# EAGLE design garden_circ (EAGLE 6.4)
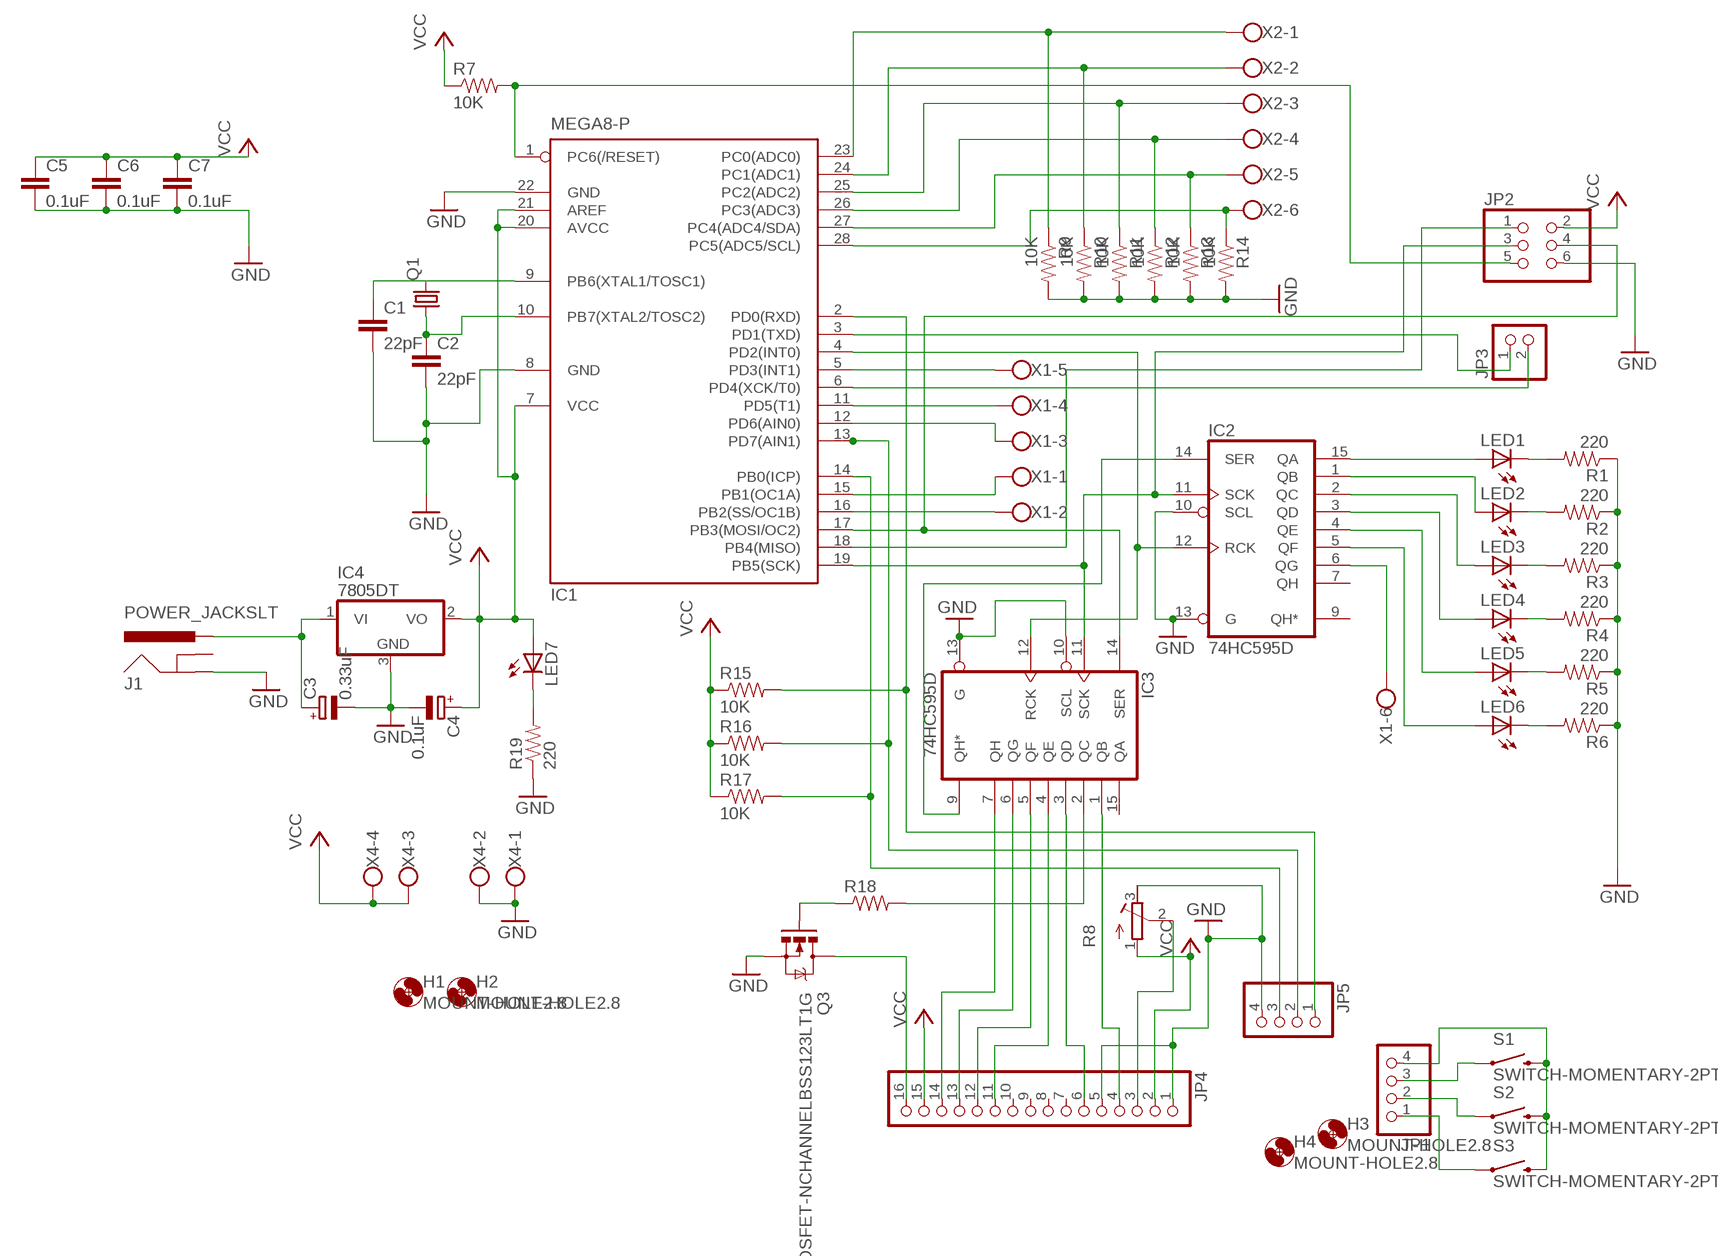
[diagram p0: schematic, sheet 1]

## Parts
C1  22pF  CAP0805  [0805]
C2  22pF  CAP0805  [0805]
C3  0.33uF  CPOL-EUSMCC  [SMC_C]
C4  0.1uF  CPOL-EUSMCC  [SMC_C]
C5  0.1uF  CAP0805  [0805]
C6  0.1uF  CAP0805  [0805]
C7  0.1uF  CAP0805  [0805]
H1  MOUNT-HOLE2.8  [2,8]
H2  MOUNT-HOLE2.8  [2,8]
H3  MOUNT-HOLE2.8  [2,8]
H4  MOUNT-HOLE2.8  [2,8]
IC1  MEGA8-P  [DIL28-3]
IC2  74HC595D  [SO16]
IC3  74HC595D  [SO16]
IC4  7805DT  [TO252]
J1  POWER_JACKSLT  [POWER_JACK_SLOT]
JP1  PINHD-1X4  [1X04]
JP2  PINHD-2X3  [2X03]
JP3  PINHD-1X2  [1X02]
JP4  PINHD-1X16  [1X16]
JP5  PINHD-1X4  [1X04]
LED1  LED3MM  [LED3MM]
LED2  LED3MM  [LED3MM]
LED3  LED3MM  [LED3MM]
LED4  LED3MM  [LED3MM]
LED5  LED3MM  [LED3MM]
LED6  LED3MM  [LED3MM]
LED7  LEDSML0805  [SML0805]
Q1  CRYSTALHC49UP  [HC49UP]
Q3  MOSFET-NCHANNELBSS123LT1G  [SOT23]
R1  220  RESISTOR0805-RES  [0805]
R2  220  RESISTOR0805-RES  [0805]
R3  220  RESISTOR0805-RES  [0805]
R4  220  RESISTOR0805-RES  [0805]
R5  220  RESISTOR0805-RES  [0805]
R6  220  RESISTOR0805-RES  [0805]
R7  10K  RESISTOR0805-RES  [0805]
R8  R-TRIMM3202  [RTRIM3202]
R9  10K  RESISTOR0805-RES  [0805]
R10  10K  RESISTOR0805-RES  [0805]
R11  10K  RESISTOR0805-RES  [0805]
R12  10K  RESISTOR0805-RES  [0805]
R13  10K  RESISTOR0805-RES  [0805]
R14  10K  RESISTOR0805-RES  [0805]
R15  10K  RESISTOR0805-RES  [0805]
R16  10K  RESISTOR0805-RES  [0805]
R17  10K  RESISTOR0805-RES  [0805]
R18  RESISTOR0805-RES  [0805]
R19  220  RESISTOR0805-RES  [0805]
S1  SWITCH-MOMENTARY-2PTH  [TACTILE-PTH]
S2  SWITCH-MOMENTARY-2PTH  [TACTILE-PTH]
S3  SWITCH-MOMENTARY-2PTH  [TACTILE-PTH]
X1  W237-136  [W237-136]
X2  W237-136  [W237-136]
X4  W237-4  [W237-4]

## Nets
GND: C1.2 C2.2 C3.- C4.- C5.2 C6.2 C7.2 IC1.8(GND) IC1.22(GND) IC2.10(SCL) IC2.13(G) IC3.10(SCL) IC3.13(G) IC4.3(GND) J1.GND@2(GND) JP2.6 JP4.1 JP4.5 JP5.4 Q3.2(S) R1.1 R2.1 R3.1 R4.1 R5.1 R6.1 R8.3(A) R9.2 R10.2 R11.2 R12.2 R13.2 R14.2 R19.1 X4.1 X4.2
MISO: IC1.18(PB4(MISO)) JP2.1
N$1: C1.1 IC1.9(PB6(XTAL1/TOSC1)) Q1.2
N$2: C2.1 IC1.10(PB7(XTAL2/TOSC2)) Q1.1
N$3: LED1.K(C) R1.2
N$4: LED2.K(C) R2.2
N$5: LED3.K(C) R3.2
N$6: LED4.K(C) R4.2
N$7: LED5.K(C) R5.2
N$8: LED6.K(C) R6.2
N$9: IC2.6(QG) X1.6
N$10: IC1.1(PC6(/RESET)) JP2.5 R7.2
N$11: IC2.15(QA) LED1.A
N$12: IC2.1(QB) LED2.A
N$13: IC2.2(QC) LED3.A
N$14: IC2.3(QD) LED4.A
N$15: IC1.11(PD5(T1)) X1.4
N$16: IC2.4(QE) LED5.A
N$17: IC2.5(QF) LED6.A
N$19: IC1.6(PD4(XCK/T0)) JP3.2
N$20: IC1.19(PB5(SCK)) IC2.11(SCK) IC3.11(SCK) JP2.3
N$21: IC2.14(SER) IC3.9(QH*)
N$23: IC1.12(PD6(AIN0)) X1.3
N$24: IC1.15(PB1(OC1A)) X1.1
N$25: IC1.24(PC1(ADC1)) R10.1 X2.2
N$26: IC3.3(QD) JP4.6
N$27: IC3.1(QB) JP4.4
N$28: IC3.7(QH) JP4.14
N$29: IC3.6(QG) JP4.13
N$30: IC3.5(QF) JP4.12
N$31: IC1.23(PC0(ADC0)) R9.1 X2.1
N$32: IC1.25(PC2(ADC2)) R11.1 X2.3
N$33: IC1.26(PC3(ADC3)) R12.1 X2.4
N$34: IC1.27(PC4(ADC4/SDA)) R13.1 X2.5
N$35: IC1.28(PC5(ADC5/SCL)) R14.1 X2.6
N$36: IC1.16(PB2(SS/OC1B)) X1.2
N$37: C3.+ IC4.1(VI) J1.PWR
N$39: IC1.2(PD0(RXD)) JP5.1 R15.2
N$40: IC1.13(PD7(AIN1)) JP5.2 R16.2
N$41: IC1.14(PB0(ICP)) JP5.3 R17.2
N$42: IC1.5(PD3(INT1)) X1.5
N$44: IC1.17(PB3(MOSI/OC2)) IC3.14(SER) JP2.4
N$45: IC1.3(PD1(TXD)) JP3.1
N$52: IC1.4(PD2(INT0)) IC2.12(RCK) IC3.12(RCK)
N$59: JP4.3 R8.2(S)
N$65: IC3.4(QE) JP4.11
N$66: JP1.1 S3.1
N$67: JP4.16 Q3.3(D)
N$68: Q3.1(G) R18.1
N$69: IC3.2(QC) R18.2
N$70: JP1.2 S2.1
N$71: JP1.3 S1.1
N$72: JP1.4 S1.3 S2.3 S3.3
N$73: LED7.C R19.2
VCC: C4.+ C5.1 C6.1 C7.1 IC1.7(VCC) IC1.20(AVCC) IC1.21(AREF) IC4.2(VO) JP2.2 JP4.2 JP4.15 LED7.A R7.1 R8.1(E) R15.1 R16.1 R17.1 X4.3 X4.4
Unconnected: IC2.7(QH) IC2.9(QH*) IC3.15(QA) J1.GND@1(GNDBREAK) JP4.7 JP4.8 JP4.9 JP4.10

## Power pins joined to a net without a drawn wire
GND: IC2.8(GND) IC3.8(GND)
VCC: IC2.16(VCC) IC3.16(VCC)

## Library data of the parts
C1 C2 C5-C7 = SparkFun-Capacitors:CAP: Capacitor Standard 0603 ceramic capacitor, and 0.1" leaded capacitor.
C3 C4 = resistor:CPOL-EU: POLARIZED CAPACITOR, European symbol
H1-H4 = holes:MOUNT-HOLE: MOUNTING HOLE with drill center marker
IC1 = atmel:MEGA8-P: MICROCONTROLLER 8 Kbytes FLASH, 1 kbytes SRAM, 512 bytes EEPROM, USART, 4-channel 10 bit ADC, 2-channel 8 bit ADC Pin compatible with Atmega48, ATMega88, ATMega168 Source: avr.lbr; OC_FARNELL: unknown; OC_NEWARK: unknown
IC2 IC3 = 74xx-eu:74*595: 8-bit SHIFT REGISTER, output latch
IC4 = linear:78*: Positive VOLTAGE REGULATOR Source: http://cache.national.com/ds/LM/LM78L05.pdf http://www.fairchildsemi.com/ds/LM/LM7805.pdf
J1 = SparkFun-Connectors:POWER_JACK: Power Jack This is the standard 5.5mm barrel jack for power. The PTH is the most common, proven, reliable, footprint. The Slot footprint only works if the mill layer is transmitted to the PCB fab house so be warned. Spark Fun Electronics SKU : PRT-00119 SMT: CONN-08106 Mating wall wart : TOL-00298 (and others)
JP1 JP5 = pinhead:PINHD-1X4: PIN HEADER
JP2 = pinhead:PINHD-2X3: PIN HEADER
JP3 = pinhead:PINHD-1X2: PIN HEADER
JP4 = pinhead:PINHD-1X16: PIN HEADER
LED1-LED7 = led:LED: LED OSRAM: - CHIPLED LG R971, LG N971, LY N971, LG Q971, LY Q971, LO R971, LY R971 LH N974, LH R974 LS Q976, LO Q976, LY Q976 LO Q996 - Hyper CHIPLED LW Q18S LB Q993, LB Q99A, LB R99A - SideLED LS A670, LO A670, LY A670, LG A670, LP A670 LB A673, LV A673, LT A673, LW A673 LH A674 LY A675 LS A676, LA A676, LO A676, LY A676, LW A676 LS A679, LY A679, LG A679 - Hyper Micro SIDELED® LS Y876, LA Y876, LO Y876, LY Y876 LT Y87S - SmartLED LW L88C, LW L88S LB L89C, LB L89S, LG L890 LS L89K, LO L89K, LY L89K LS L896, LA L896, LO L896, LY L896 - TOPLED LS T670, LO T670, LY T670, LG T670, LP T670 LSG T670, LSP T670, LSY T670, LOP T670, LYG T670 LG T671, LOG T671, LSG T671 LB T673, LV T673, LT T673, LW T673 LH T674 LS T676, LA T676, LO T676, LY T676, LB T676, LH T676, LSB T676, LW T676 LB T67C, LV T67C, LT T67C, LS T67K, LO T67K, LY T67K, LW E67C LS E67B, LA E67B, LO E67B, LY E67B, LB E67C, LV E67C, LT E67C LW T67C LS T679, LY T679, LG T679 LS T770, LO T770, LY T770, LG T770, LP T770 LB T773, LV T773, LT T773, LW T773 LH T774 LS E675, LA E675, LY E675, LS T675 LS T776, LA T776, LO T776, LY T776, LB T776 LHGB T686 LT T68C, LB T68C - Hyper Mini TOPLED® LB M676 - Mini TOPLED Santana® LG M470 LS M47K, LO M47K, LY M47K Source: http://www.osram.convergy.de LUXEON: - LUMILED® LXK2-PW12-R00, LXK2-PW12-S00, LXK2-PW14-U00, LXK2-PW14-V00 LXK2-PM12-R00, LXK2-PM12-S00, LXK2-PM14-U00 LXK2-PE12-Q00, LXK2-PE12-R00, LXK2-PE12-S00, LXK2-PE14-T00, LXK2-PE14-U00 LXK2-PB12-K00, LXK2-PB12-L00, LXK2-PB12-M00, LXK2-PB14-N00, LXK2-PB14-P00, LXK2-PB14-Q00 LXK2-PR12-L00, LXK2-PR12-M00, LXK2-PR14-Q00, LXK2-PR14-R00 LXK2-PD12-Q00, LXK2-PD12-R00, LXK2-PD12-S00 LXK2-PH12-R00, LXK2-PH12-S00 LXK2-PL12-P00, LXK2-PL12-Q00, LXK2-PL12-R00 Source: www.luxeon.com KINGBRIGHT: KA-3528ASYC Source: www.kingbright.com
Q1 = crystal:CRYSTAL: CRYSTAL; OC_FARNELL: unknown; OC_NEWARK: unknown
Q3 = SparkFun-DiscreteSemi:MOSFET-NCHANNEL: Common NMOSFET Parts MFG P/N Store ID Prod ID FDD8780 TRANS-09984 SI7820DN TRANS-11055 FDS6630A IC-08089 2N7002PW TRANS-11151 FQP30N06L COM-10213 TRANS-10060 BSS123LT1G TRANS-08345 BSS138 TRANS-00830 BS170 2N7000; PROD_ID: TRANS-08345
R1-R7 R9-R19 = SparkFun-Resistors:RESISTOR: Resistor Basic schematic elements and footprints for 0603, 1206, and PTH resistors.
R8 = resistor:R-TRIMM: Trimm resistor
S1-S3 = SparkFun-Electromechanical:SWITCH-MOMENTARY-2: Various NO switches- pushbuttons, reed, etc
X1 X2 = con-wago-500:W237-136: WAGO SCREW CLAMP; MPN: 237-136; OC_FARNELL: unknown; OC_NEWARK: 84K9151
X4 = con-wago-500:W237-4: WAGO SCREW CLAMP; OC_FARNELL: unknown; OC_NEWARK: unknown

## Board
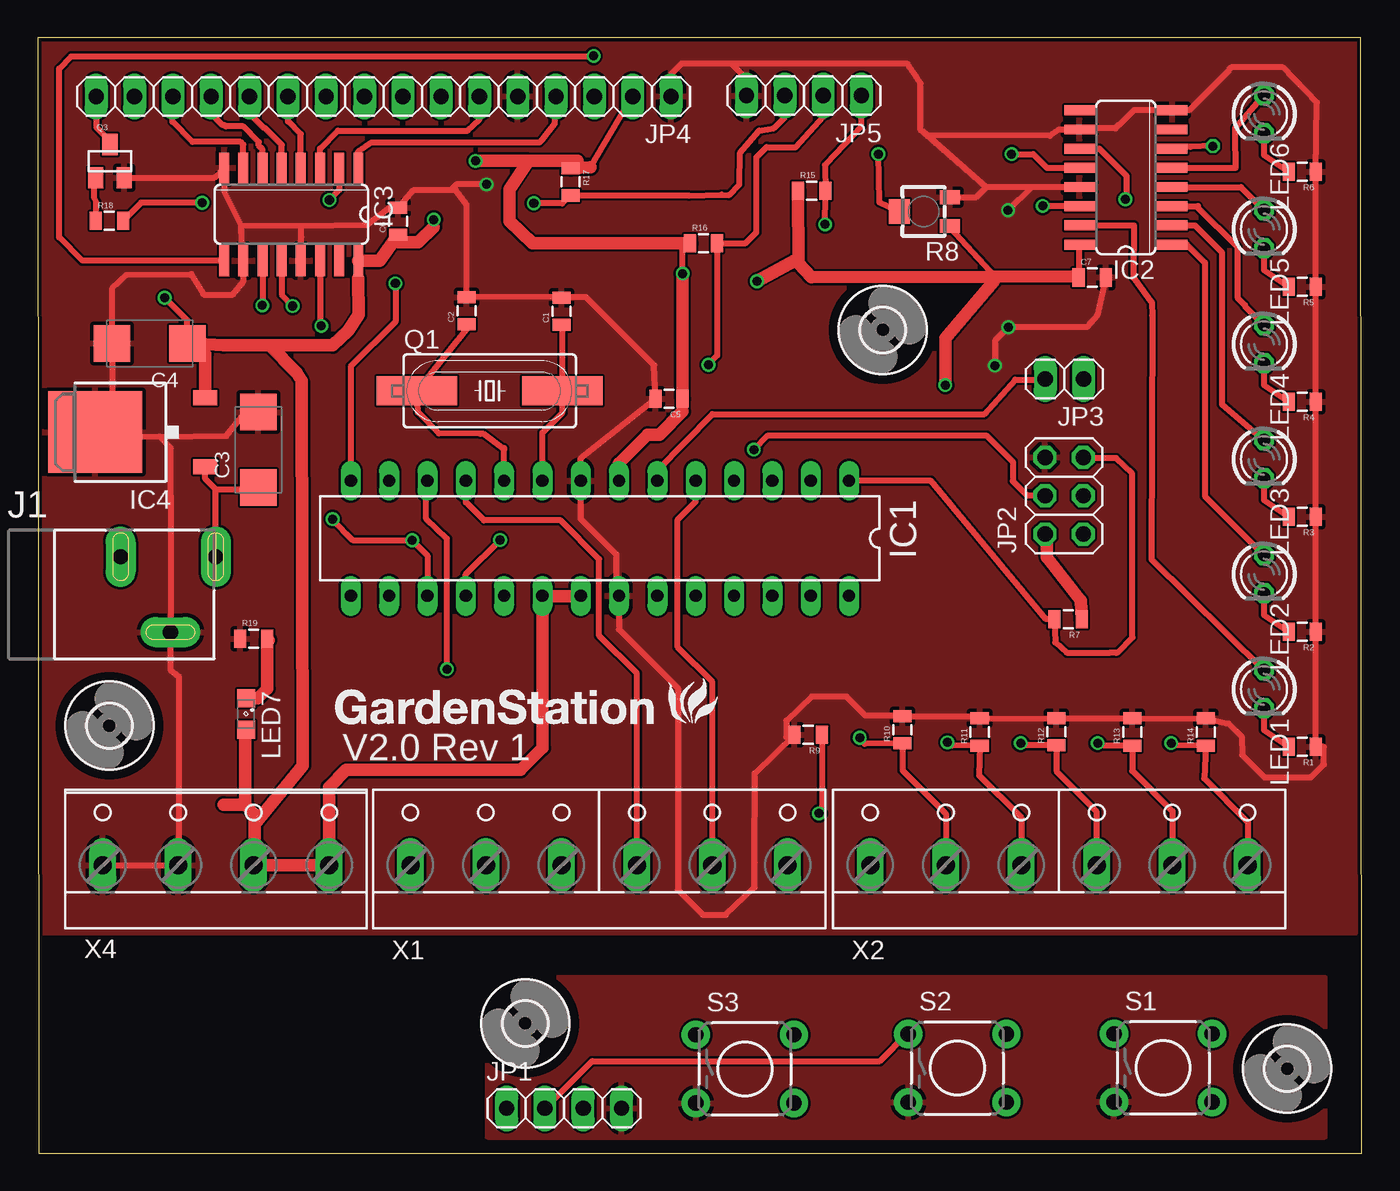
[diagram p1: board, top side]
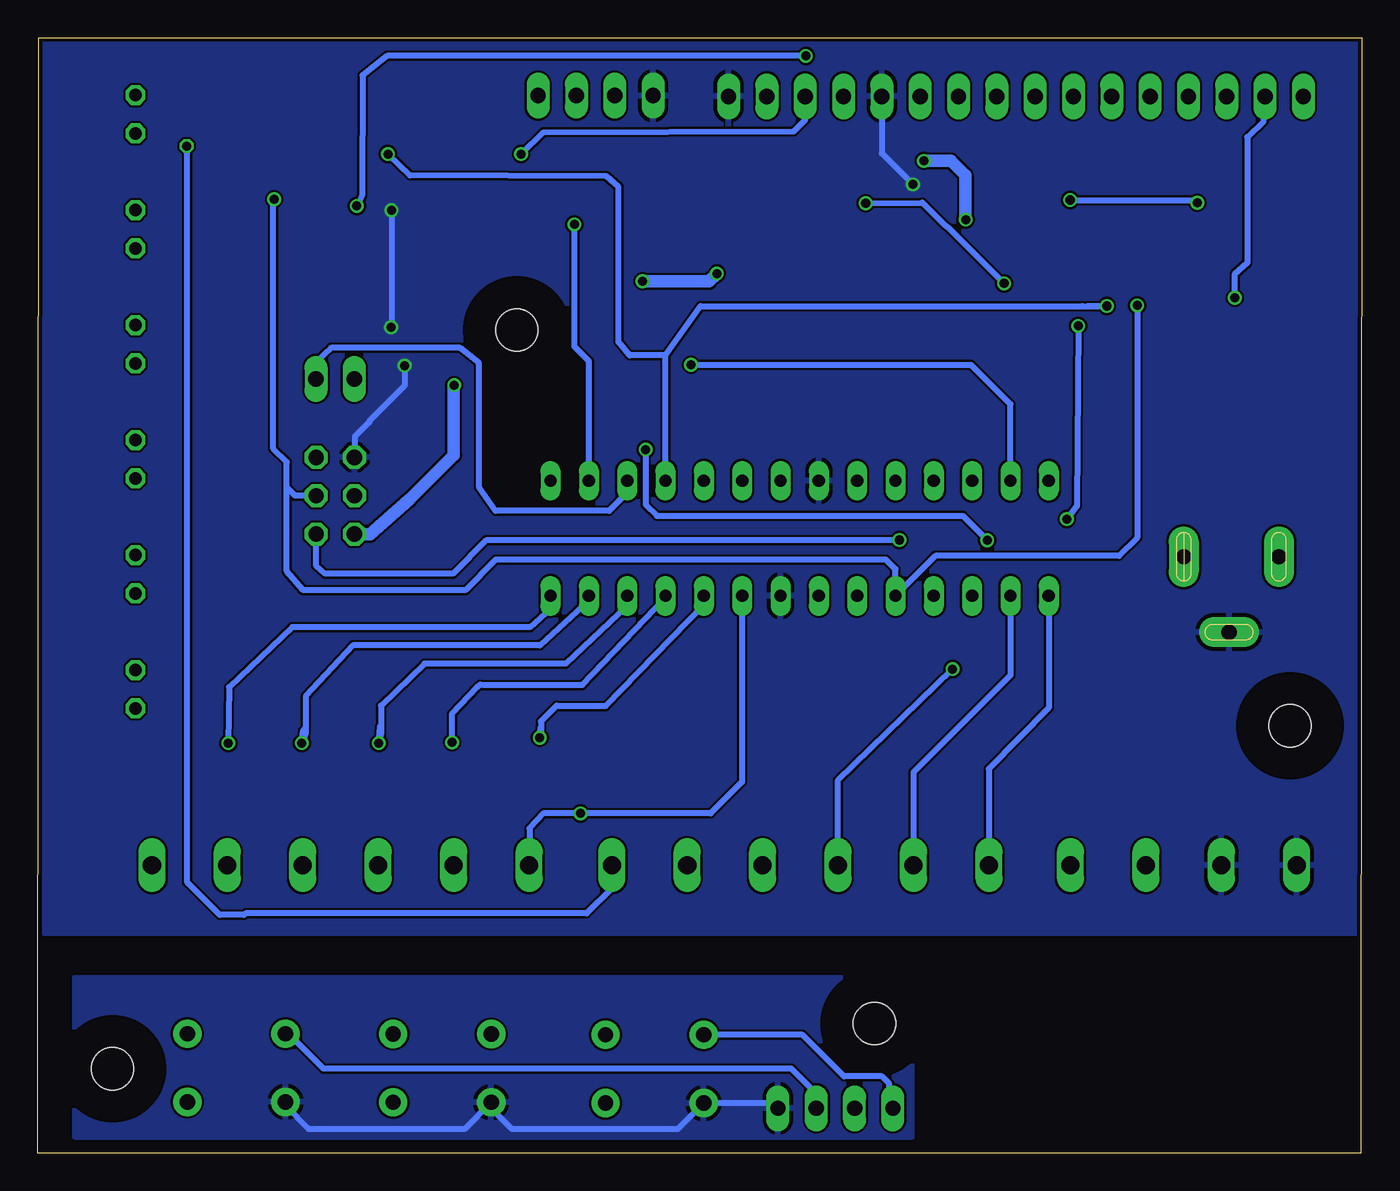
[diagram p2: board, bottom side, seen from below]

Size 87.76 x 73.91 mm. Coordinates in mm from the lower left corner, seen from the top.
Outline: 0.05,0 87.76,0 87.71,73.91 0,73.91 0.05,0
Copper layers (1*16): Top 0.035mm / dielectric 1.5mm / Bottom 0.035mm
Design rules "Elecrow_2-layer_eagle_rule": minimum track width 6mil, minimum drill 12mil, track to track 6mil, track to pad 6mil, pad to pad 6mil, via to via 6mil, smd to smd 0mil, copper to edge 10mil, drill to drill 10mil, minimum pad ring 10mil, minimum via ring 6mil, stop-mask expansion 2mil, vias tented up to drill 100mil, thermal gap 10mil

### Footprints (pad centres in the part's own frame; a part is rotated, then mirrored left to right if it is on the bottom)
0805 = smd 0.8 x 1.2: 1 -0.9,0; 2 0.9,0
SMC_C = smd 2.4 x 2.4: + -2.5,0; - 2.5,0
2,8 = hole 2.8: 0,0
DIL28-3 = drill 0.813 long: 1 -16.51,-3.81; 2 -13.97,-3.81; 3 -11.43,-3.81; 4 -8.89,-3.81; 5 -6.35,-3.81; 6 -3.81,-3.81; 7 -1.27,-3.81; 8 1.27,-3.81; 9 3.81,-3.81; 10 6.35,-3.81; 11 8.89,-3.81; 12 11.43,-3.81; 13 13.97,-3.81; 14 16.51,-3.81; 15 16.51,3.81; 16 13.97,3.81; 17 11.43,3.81; 18 8.89,3.81; 19 6.35,3.81; 20 3.81,3.81; 21 1.27,3.81; 22 -1.27,3.81; 23 -3.81,3.81; 24 -6.35,3.81; 25 -8.89,3.81; 26 -11.43,3.81; 27 -13.97,3.81; 28 -16.51,3.81
SO16 = smd 0.66 x 2.032: 1 -4.445,-3.073; 2 -3.175,-3.073; 3 -1.905,-3.073; 4 -0.635,-3.073; 5 0.635,-3.073; 6 1.905,-3.073; 7 3.175,-3.073; 8 4.445,-3.073; 9 4.445,3.073; 10 3.175,3.073; 11 1.905,3.073; 12 0.635,3.073; 13 -0.635,3.073; 14 -1.905,3.073; 15 -3.175,3.073; 16 -4.445,3.073
TO252 = smd 1 x 1.6: 1 -2.28,-4.8; 2 2.28,-4.8 | smd 5.4 x 6.2: 3 0,2.5
POWER_JACK_SLOT = drill 1 pad 2 long: GND@1 2.58,7.5; GND@2 7.58,10.8; PWR 2.58,13.8
1X04 = drill 1.016 long: 1 -3.81,0; 2 -1.27,0; 3 1.27,0; 4 3.81,0
2X03 = drill 1.016 octagon: 1 -2.54,-1.27; 2 -2.54,1.27; 3 0,-1.27; 4 0,1.27; 5 2.54,-1.27; 6 2.54,1.27
1X02 = drill 1.016 long: 1 -1.27,0; 2 1.27,0
1X16 = drill 1.016 long: 1 -19.05,0; 2 -16.51,0; 3 -13.97,0; 4 -11.43,0; 5 -8.89,0; 6 -6.35,0; 7 -3.81,0; 8 -1.27,0; 9 1.27,0; 10 3.81,0; 11 6.35,0; 12 8.89,0; 13 11.43,0; 14 13.97,0; 15 16.51,0; 16 19.05,0
LED3MM = drill 0.813 octagon: A -1.27,0; K 1.27,0
SML0805 = smd 1.2 x 1.2: A 1.05,0; C -1.05,0
HC49UP = smd 5.334 x 1.93: 1 -4.826,0; 2 4.826,0
SOT23 = smd 1 x 1.4: 1 -0.95,-1.1; 2 0.95,-1.1; 3 0,1.1
RTRIM3202 = smd 0.9 x 1.3: 1 -0.95,-1.75; 3 0.95,-1.75 | smd 1.6 x 1.4: 2 0,1.6
TACTILE-PTH = drill 1.016 pad 1.88: 1 -3.251,2.261; 2 3.251,2.261; 3 -3.251,-2.261; 4 3.251,-2.261
W237-136 = drill 1.194 long: 1 -12.5,-1.27; 2 -7.5,-1.27; 3 -2.5,-1.27; 4 2.5,-1.27; 5 7.5,-1.27; 6 12.5,-1.27
W237-4 = drill 1.194 long: 1 -7.5,-1.27; 2 -2.5,-1.27; 3 2.5,-1.27; 4 7.5,-1.27

### Placement (x,y rotation side)
C1  34.71,55.78 90 top
C2  28.42,55.81 90 top
C3  14.62,46.6 90 top
C4  7.42,53.65 180 top
C5  41.84,49.98 180 top
C6  23.9,61.75 90 top
C7  69.89,58.02 0 top
H1  4.75,28.32 0 top
H2  56.01,54.55 0 top
H3  32.31,8.6 0 top
H4  82.81,5.6 0 top
IC1  37.26,40.74 180 top
IC2  72.12,64.65 90 top
IC3  16.81,62.2 180 top
IC4  6.31,47.77 90 top
J1  -2,42.1 270 top
JP1  34.89,2.97 0 top
JP2  68.03,43.56 90 top
JP3  68.05,51.3 180 top
JP4  22.92,70.02 180 top
JP5  50.78,70.07 180 top
LED1  81.28,30.74 270 top
LED2  81.28,38.36 270 top
LED3  81.28,45.98 270 top
LED4  81.28,53.6 270 top
LED5  81.28,61.22 270 top
LED6  81.28,68.84 270 top
LED7  13.81,29.1 270 top
Q1  29.96,50.51 0 top
Q3  4.79,65.73 0 top
R1  83.82,26.93 180 top
R2  83.82,34.55 180 top
R3  83.82,42.17 180 top
R4  83.82,49.79 180 top
R5  83.82,57.41 180 top
R6  83.82,65.03 180 top
R7  68.3,35.36 180 top
R8  58.71,62.39 90 top
R9  51.07,27.71 180 top
R10  57.32,28.05 90 top
R11  62.43,27.91 90 top
R12  67.53,27.92 90 top
R13  72.55,27.91 90 top
R14  77.43,27.91 90 top
R15  51.3,63.78 0 top
R16  44.14,60.29 0 top
R17  35.33,64.35 270 top
R18  4.75,61.77 0 top
R19  14.31,34.1 0 top
S1  74.59,5.65 0 top
S2  60.95,5.64 0 top
S3  46.87,5.58 0 top
X1  37.21,20.36 0 top
X2  67.69,20.36 0 top
X4  11.81,20.36 0 top

### Tracks (layer width: path | path; a pad name or v marks a point on that pad's centre or on a via)
GND  (via drill 0.6)
  Top 0.406: 58.95,67.45 67.09,67.4 67.69,67.83 IC2.10 69.12,67.9 71.43,67.9 71.66,68.13 71.68,68.13 72.64,69.1 IC2.8 75.21,69.11 76.32,69.11 78.97,71.76 78.97,71.81 79.09,71.94 82.54,71.94 84.78,69.61 R6.1 R5.1 R4.1 R3.1 R2.1 R1.1 85.24,26.93 85.24,25.76 84.37,24.89 81.31,24.89 79.84,26.37 79.8,27.59 78.92,28.46 R14.2 77.72,28.8 R13.2 72.78,28.83 R12.2 67.97,28.8 R11.2 62.38,28.94 R10.2 57.27,28.99 54.86,28.99 53.61,30.24 51.3,30.24 49.61,28.66 49.61,27.59 R9.2 47.53,25.18 47.51,19.26 47.51,17.62 45.59,15.79 44.99,15.79 44.94,15.79 44.08,15.79 42.43,17.44 42.43,30.81 38.53,34.71 IC1.22 38.34,37.12 38.34,39.68 35.99,42.03 IC1.8 35.99,46.03 C5.2 40.85,52.22 36.33,56.72 35.05,56.72 C1.2 34.38,56.73 C2.2 28.41,62.85 27.71,63.81 27.37,63.81 | 58.95,67.45 58.52,67.83 58.52,70.89 58.23,71.32 57.65,72.17 45.98,72.19 | 27.37,63.81 24.9,63.79 C6.2 23.31,62.65 21.8,61.48 17.46,61.41 | 13.5,60.36 13.5,61.47 12.36,63.71 IC3.8 11.72,64.63 Q3.2 | 13.5,60.36 13.5,59.26 IC3.10 13.64,59.12 13.64,57.78 12.91,56.89 11.01,56.89 10.96,56.93 10.19,58.16 10.19,58.25 5.89,58.19 4.95,57.31 C4.- 4.92,48.88 IC4.3 5.78,47.5 8.08,47.48 | 8.08,47.48 12.5,47.53 13.73,49.11 C3.- | X4.1 X4.2 9.36,19.14 9.36,31.58 8.8,32.03 J1.GND@2 8.81,35.4 8.82,43.54 8.82,46.69 8.08,47.48 | 17.46,61.41 13.48,61.46 13.5,60.36 | IC3.13 17.46,60.69 17.46,61.41 | 62.89,64.02 IC2.13 65.85,64.02 v64.31,62.48 | 62.89,64.02 58.95,67.45 | C7.2 70.22,55.53 69.54,54.73 v64.33,54.73 63.44,53.84 v63.44,52.18 | 13.46,61.5 13.5,60.36 | 45.98,72.19 42.68,72.19 42.04,71.55 42.04,70.08 JP4.1 | JP5.4 46.98,71.2 45.98,72.19
  Top 0.406: 58.64,67.73 62.89,64.02 | R8.3 62.21,63.34 62.89,64.02 | v29.75,64.19 27.75,64.19 27.37,63.81
  Bottom 0.406: v63.44,52.18 63.44,50.83 65.79,48.49 65.79,48.41 66.75,47.45 66.75,46.11 JP2.6 | v64.31,62.48 64.31,54.74 v64.33,54.73 | JP4.5 31.81,66.25 v29.75,64.19
  pour Bottom: 0.31,73.6 87.31,73.6 87.31,14.6 0.31,14.6
  pour Top: 0.31,73.6 87.31,73.6 87.31,14.6 0.31,14.6
MISO  (via drill 0.6)
  Top 0.406: IC1.18 28.37,38.36 v30.64,40.63
  Bottom 0.406: v30.64,40.63 58.04,40.61 60.24,38.4 68.71,38.4 69.29,38.92 JP2.1
N$1
  Top 0.406: C1.1 34.77,54.66 Q1.2 34.78,50.12 34.78,49.07 33.45,47.74 IC1.9
N$2
  Top 0.406: IC1.10 30.92,46.64 | 30.92,46.64 30.92,46.71 | 30.92,46.64 29.54,47.67 29.33,47.67 26.59,47.69 25.2,49.09 Q1.1 28.43,54.6 C2.1
N$3
  Top 0.406: LED1.K 81.28,28.04 R1.2
N$4
  Top 0.406: LED2.K 81.28,35.66 R2.2
N$5
  Top 0.406: LED3.K 81.28,43.28 R3.2
N$6
  Top 0.406: LED4.K 81.28,50.9 R4.2
N$7
  Top 0.406: LED5.K 81.28,58.52 R5.2
N$8
  Top 0.406: LED6.K 81.28,66.14 R6.2
N$9  (via drill 0.6)
  Top 0.406: v77.88,66.73 77.88,66.76 76.41,66.67 75.31,66.67 IC2.6
  Bottom 0.406: X1.6 49.71,17.56 51.37,15.9 73.97,15.9 74.08,15.79 75.7,15.79 77.85,17.94 77.85,66.8 v77.88,66.73
N$10
  Top 0.406: 71.04,33.14 68.21,33.16 67.44,33.85 R7.2 66.82,35.38 59.21,44.54 53.78,44.54 IC1.1 | 71.48,33.14 71.04,33.14 | 71.04,33.14 71.59,33.18 72.56,34.17 72.55,45.04 71.48,46.05 69.24,46.03 69.33,46.03 69.33,46.07 JP2.5
N$11
  Top 0.406: IC2.15 72.66,61.48 72.62,58.03 73.84,56.36 73.86,55.49 73.83,39.35 LED1.A
N$12
  Top 0.406: IC2.1 76.17,60.21 77.37,59.01 77.37,43.54 LED2.A
N$13
  Top 0.406: IC2.2 76.7,61.48 78.49,59.69 78.49,49.61 LED3.A
N$14
  Top 0.406: IC2.3 76.9,62.75 76.87,62.75 76.87,62.67 79.52,60.06 79.52,56.68 80.02,56.18 80.02,56.13 LED4.A
N$15
  Top 0.406: X1.4 39.71,31.79 37.22,34.28 37.22,39.36 34.66,41.93 29.57,41.93 28.38,43.12 28.38,44.54 IC1.11
N$16
  Top 0.406: IC2.4 79.75,64.02 LED5.A
N$17
  Top 0.406: IC2.5 79.41,65.29 79.38,67.51 79.38,67.92 LED6.A
N$19
  Top 0.406: IC1.6 41.07,45.24 44.72,48.97 62.73,48.97 64.8,51.26 66.76,51.26 66.76,51.27 JP3.2
N$20  (via drill 0.6)
  Top 0.406: IC2.11 70.36,66.56 72.16,64.75 72.16,63.28 v72.09,63.21 | IC3.11 14.9,56.18 v14.89,56.17
  Bottom 0.406: 72.07,63.23 v72.09,63.21 72.14,63.15 72.14,46.69 71.25,45.8 71.25,44.11 | v14.89,56.17 14.89,40.79 16.1,39.58 28.26,39.58 IC1.19 30.91,38.69 31.55,39.33 57.4,39.33 59.41,37.3 70.17,37.3 71.25,38.56 71.25,44.11 | JP2.3 70.7,43.56 71.25,44.11
N$21  (via drill 0.6)
  Top 0.406: IC3.9 2.96,59.13 1.41,60.68 1.41,71.87 2.21,72.67 36.81,72.67 v36.84,72.7 | v66.61,62.76 69.03,62.76 IC2.14
  Bottom 0.406: v36.84,72.7 64.6,72.7 66.24,71.4 66.27,63.42 v66.61,62.76
N$23  (via drill 0.6)
  Top 0.406: v27.12,32.08 27.12,33.28 27.12,33.91 27.12,34.42 27.12,35.17 27.12,40.72 25.75,42.03 25.75,44.47 IC1.12
  Bottom 0.406: X1.3 34.71,24.72 v27.12,32.08
N$24
  Bottom 0.406: IC1.15 20.75,29.5 24.72,25.46 24.72,19.21 X1.1
N$25  (via drill 0.6)
  Top 0.406: X2.2 60.19,22.49 57.32,25.36 R10.1 54.83,27.13 v54.48,27.52
  Bottom 0.406: IC1.24 43.61,36.33 50.11,29.62 53.19,29.62 53.36,29.66 | 53.36,29.66 | 53.36,29.66 54.41,28.61 54.41,27.99 | 54.41,27.99 54.45,27.67 54.43,28.23 v54.48,27.52 54.41,27.99
N$26
  Top 0.406: IC3.3 18.71,66.55 19.88,67.76 28.51,67.76 29.27,68.49 JP4.6
N$27
  Top 0.406: IC3.1 21.25,66.37 22.11,66.98 33.25,66.98 33.5,67.23 33.56,67.3 34.29,68.24 34.29,70.09 | 34.29,70.1 34.29,70.09 | 34.29,70.09 JP4.4
N$28
  Top 0.406: IC3.7 13.63,66.83 13.45,67.01 10.25,67.01 8.93,68.33 8.93,69.99 JP4.14
N$29
  Top 0.406: IC3.6 14.9,66.52 14.66,66.76 14.66,66.99 13.62,68.03 12.47,68.03 12.38,68.12 12.26,68.12 11.49,68.88 JP4.13
N$30
  Top 0.406: IC3.5 16.17,66.81 15.07,67.92 15.01,67.92 14.05,68.88 14.05,70 JP4.12
N$31  (via drill 0.6)
  Top 0.406: R9.1 51.99,22.97 v51.78,22.51
  Bottom 0.406: IC1.23 41.07,24.6 43.16,22.51 v51.78,22.51 54.23,22.51 55.18,21.51 55.19,19.07 X2.1
N$32  (via drill 0.6)
  Top 0.406: X2.3 65.19,22.24 62.4,25.03 R11.1 60.61,27.02 v60.3,27.22
  Bottom 0.406: IC1.25 46.15,36.8 51.67,31.01 58.25,31.01 58.43,31.04 58.64,30.88 60.3,29.11 v60.3,27.22
N$33  (via drill 0.6)
  Top 0.406: X2.4 70.17,19.11 70.17,22.67 67.53,25.31 R12.1 65.55,27.04 v65.15,27.17
  Bottom 0.406: IC1.26 48.69,36.29 52.76,32.43 62.13,32.43 65.01,29.66 65.01,28.34 | 65.01,28.34 65.01,27.83 v65.15,27.17 65.08,28.27 65.01,28.34
N$34  (via drill 0.6)
  Top 0.406: X2.5 75.21,19.12 75.21,22.67 72.55,25.33 R13.1 70.69,27 v70.25,27.17
  Bottom 0.406: IC1.27 51.23,36.63 54.47,33.64 66.86,33.64 69.99,30.26 69.99,28.18 | 69.99,28.18 69.99,27.86 v70.25,27.17 70.17,28 69.99,28.18
N$35  (via drill 0.6)
  Top 0.406: X2.6 80.21,19.11 80.21,21.94 77.31,24.84 R14.1 75.28,27.02 v75.13,27.17
  Bottom 0.406: IC1.28 53.77,36.06 55.14,34.85 70.89,34.85 75.07,30.88 v75.13,27.17
N$36
  Bottom 0.406: IC1.16 23.29,31.67 29.71,25.25 29.71,19.1 X1.2
N$37
  Top 0.406: J1.PWR 11.8,43.98 | 11.8,43.98 11.1,44.68 11.1,45.51 IC4.1 | 11.8,43.98 14.91,43.98 C3.+
N$39  (via drill 0.6)
  Top 0.406: v52.19,61.54 52.21,63.44 R15.2 52.19,65.41 52.25,65.54 54.59,68.04 JP5.1
  Bottom 0.406: IC1.2 51.23,52.49 52.19,53.45 v52.19,61.54
N$40  (via drill 0.6)
  Top 0.406: v44.46,52.24 45.02,52.84 R16.2 46.93,60.29 47.64,61 47.64,65.98 48.33,66.67 48.47,66.64 50.22,66.64 52.08,68.7 52.08,70.04 JP5.2
  Bottom 0.406: IC1.13 23.29,49.63 25.89,52.24 v44.46,52.24
N$41  (via drill 0.6)
  Top 0.406: v32.88,62.94 34.76,62.93 R17.2 43.09,63.46 43.16,63.45 45.33,63.52 45.81,63.47 46.5,64.19 46.55,66.28 47.82,67.76 48.79,67.92 49.52,68.65 49.52,70.06 JP5.3 | v23.71,57.62 23.71,55.08 20.75,52.13 IC1.14
  Bottom 0.406: v32.88,62.94 29.13,62.98 27.67,61.52 27.4,61.32 v23.71,57.62
N$42
  Top 0.406: X1.5 44.71,31.23 42.41,33.53 42.41,41.98 43.6,43.17 43.6,44.54 IC1.5
N$44  (via drill 0.6)
  Top 0.406: IC3.14 18.71,54.9 v18.8,54.82 | v19.54,42.01 20.45,41.04 20.88,40.63 v24.83,40.61 25.84,39.6 IC1.17 | v47.46,46.62 48.37,47.53 62.93,47.53 64.63,45.82 64.63,44.52 65.58,43.58 66.74,43.58 JP2.4
  Bottom 0.406: v18.8,54.82 18.87,42.89 v19.54,42.01 | v47.46,46.62 47.46,42.97 46.71,42.23 26.44,42.23 v24.83,40.61
N$45
  Bottom 0.406: IC1.3 48.69,43.75 49.88,42.57 57.4,42.57 58.5,44.11 58.52,52.36 59.78,53.36 68.32,53.36 69.28,52.49 69.31,51.16 JP3.1
N$52  (via drill 0.6)
  Top 0.406: v64.55,66.19 65.99,66.19 66.89,65.29 IC2.12 | IC3.12 16.17,56.89 v16.9,56.13
  Bottom 0.406: IC1.4 46.15,52.85 | 46.15,52.85 43.82,56.13 18.53,56.13 18.16,56.12 | 18.16,56.12 v16.9,56.13 18.15,56.11 18.16,56.12 | 46.15,52.85 48.52,52.85 49.27,53.75 49.27,64.03 50.06,64.72 63.09,64.79 64.53,66.19 64.49,66.14 v64.55,66.19
N$59  (via drill 0.6)
  Top 0.406: R8.2 55.78,63.01 v55.73,66.19
  Bottom 0.406: v55.73,66.19 55.73,66.18 54.22,67.64 37.65,67.71 36.88,68.47 36.88,70 JP4.3
N$65
  Top 0.406: IC3.4 17.44,67.52 16.59,68.36 16.59,70 JP4.11
N$66
  Bottom 0.406: JP1.1 31.31,3.2 31.31,4.6 31.81,5.1 34.31,5.1 37.06,7.84 S3.1
N$67
  Top 0.406: Q3.3 4.79,67.07 3.9,67.96 3.9,69.99 JP4.16
N$68
  Top 0.406: R18.1 3.87,63.02 3.74,63.31 3.74,64.64 Q3.1
N$69  (via drill 0.6)
  Top 0.406: IC3.2 19.98,63.8 v19.33,63.15 | v10.9,62.98 6.84,62.98 R18.2
  Bottom 0.406: v19.33,63.15 11.08,63.15 v10.9,62.98
N$70
  Top 0.406: JP1.2 36.74,6.1 55.81,6.1 57.61,7.9 S2.1
N$71
  Bottom 0.406: JP1.3 36.31,3.12 36.31,4.1 37.81,5.6 68.81,5.6 71.13,7.91 S1.1
N$72
  Bottom 0.406: JP1.4 39.05,3.32 S3.3 45.35,1.6 56.31,1.6 57.7,2.99 S2.3 59.48,1.6 69.81,1.6 71.34,3.13 S1.3
  pour Top: 29.81,1.1 85.31,1.1 85.31,11.6 29.81,11.6
  pour Bottom: 29.81,11.6 85.31,11.6 85.31,1.1 29.81,1.1
N$73
  Top 0.813: 15.31,34 R19.2 15.21,30.78 14.58,30.15 LED7.C
VCC  (via drill 0.6)
  Top 0.406: 42.75,49.14 C5.1 | v42.74,58.28 42.74,60.16 R16.1 | IC3.16 21.25,57.96 | 33.47,36.91 IC1.20 | C4.+ 10.47,53.51 | 14.39,19.17 X4.3 | 35.97,36.91 IC1.21 | 31.28,63.85 31.26,63.9 31.28,63.88 | 50.41,58.98 50.23,59.15 | v26.25,61.86 26.25,61.36 | 23.91,60.36 C6.1 | 35.78,65.75 R17.1 | 36.65,65.31 JP4.2 | 11.11,52.96 10.61,52.96 C4.+ | 10.04,53.65 C4.+ | C4.+ 9.92,55.18 v8.42,56.68 | R8.1 60.47,61.36 63.48,58.07 | 68.77,58.03 69.05,58.05 IC2.16 | 63.36,57.75 63.75,57.98 63.51,58.06 | C7.1 68.6,58.02 68.65,58.09
  Top 0.813: R17.1 36.65,65.31 | IC1.7 38.53,45.73 40.42,47.61 41.22,47.61 42.75,49.14 | C5.1 v42.74,58.28 | 21.25,57.96 21.27,55.54 20.58,54.5 19.56,53.52 15.37,53.52 | 15.37,53.52 12.31,53.52 10.04,53.65 | X4.3 X4.4 19.31,24.25 20.45,25.39 32.01,25.39 33.47,26.85 33.47,36.91 35.97,36.91 | 14.39,21.78 17.57,25.67 17.48,51.17 17.16,51.72 15.37,53.52 | 14.39,21.78 14.39,19.17 | IC3.16 22.68,59.13 C6.1 | R16.1 32.8,60.29 31.28,61.73 31.28,63.85 | 31.28,63.88 32.52,65.75 | v60.16,50.89 60.16,53.98 63.36,57.75 | R15.1 50.41,58.98 51.3,58.05 63.48,58.07 63.51,58.06 68.65,58.09 68.77,58.03 | 50.23,59.15 v47.67,57.77 | 32.52,65.75 v29.02,65.75 | 26.25,61.36 25.2,60.36 23.91,60.36 | 32.52,65.75 35.78,65.75 | R7.1 69.13,36.61 66.89,39.47 66.89,40.89 JP2.2 | IC4.2 11.11,52.96 | 12.31,23.1 13.75,23.1 | 13.75,23.1 14.39,22.46 14.39,21.78 | LED7.A 13.75,27.99 13.75,23.1
  Bottom 0.406: 60.19,50.85 v60.16,50.89 | 26.28,62.12 v26.25,61.86 | v8.42,56.68 8.42,58.28 7.58,59.01 7.58,60.03 7.58,61.39 7.6,67.32 6.5,68.38 6.5,69.94 JP4.15
  Bottom 0.813: 60.19,50.85 60.19,46.23 63.14,43.28 65.72,41.01 JP2.2 | v47.67,57.77 43.26,57.77 v42.74,58.28 | v29.02,65.75 27.23,65.75 26.28,64.81 26.28,62.12

### Text on the board
tPlace: V2.0 Rev 1